# EAGLE schematic Mobo-v07 (EAGLE 5.09)

## Sheet 1 of 5
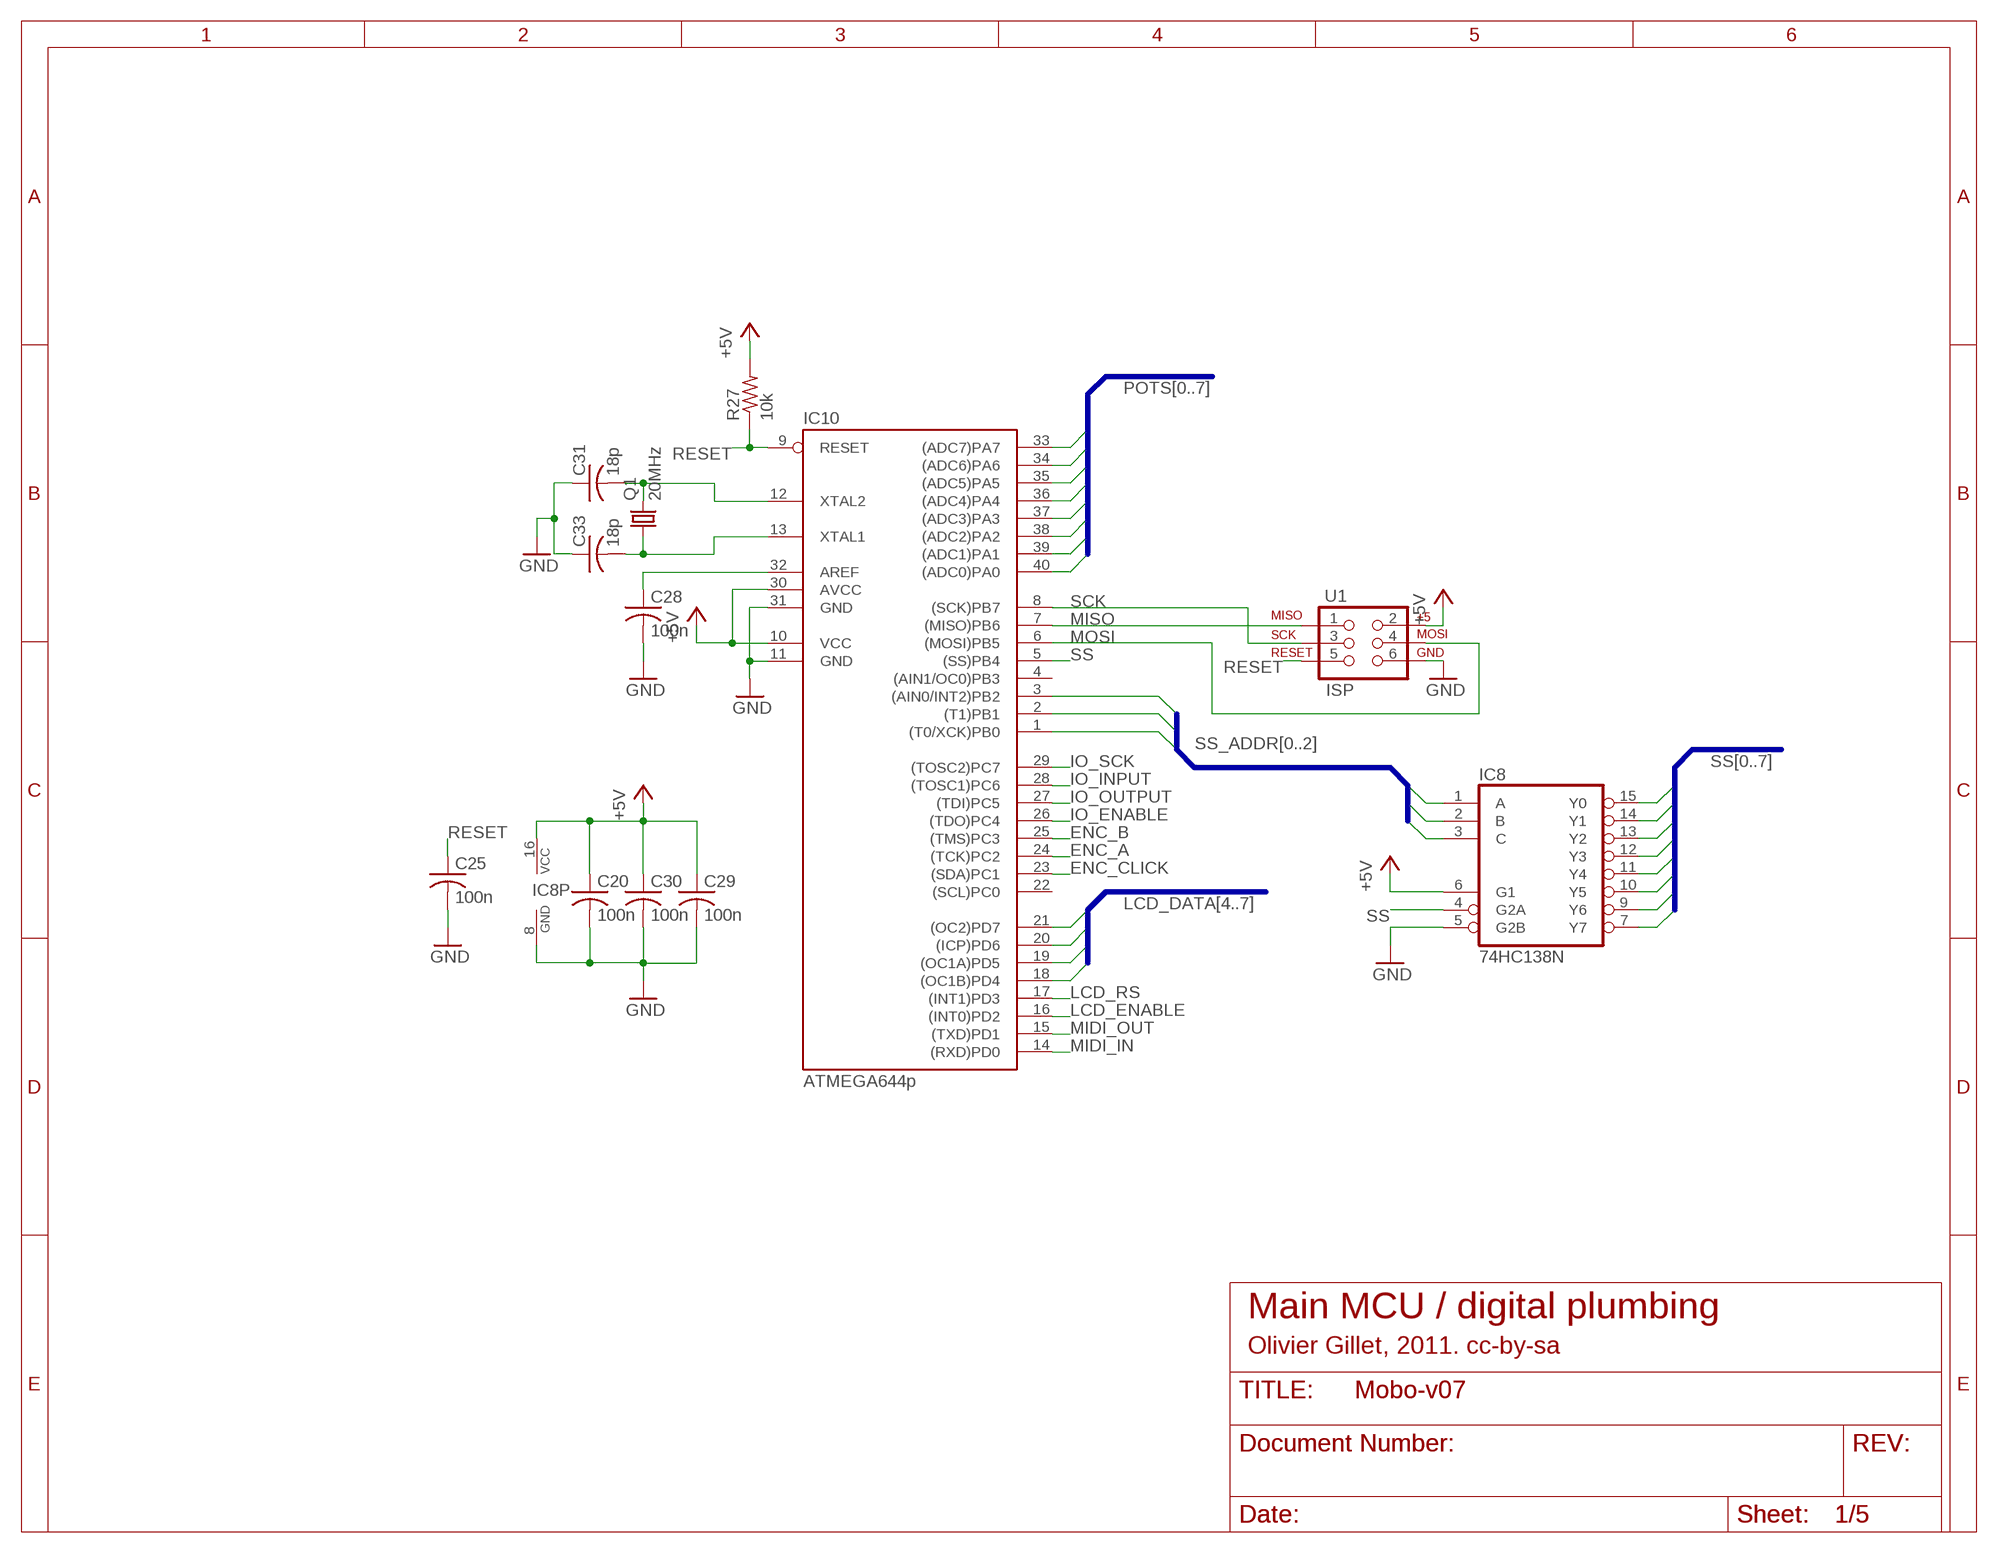
[diagram p0: schematic, sheet 1]

### Parts
C20  100n  C-US025-024X044  [C025-024X044]
C25  100n  C-US025-024X044  [C025-024X044]
C28  100n  C-US025-024X044  [C025-024X044]
C29  100n  C-US025-024X044  [C025-024X044]
C30  100n  C-US025-024X044  [C025-024X044]
C31  18p  C-US025-024X044  [C025-024X044]
C33  18p  C-US025-024X044  [C025-024X044]
IC8  74HC138N  [DIL16]
IC10  ATMEGA644p  MEGA16-P  [DIL40]
Q1  20MHz  CRYSTALHC49U-V  [HC49U-V]
R27  10k  R-US_0204/7  [0204/7]
U1  ISP  AVR_SPI_PRG_6PTH  [2X3]

### Nets
+5V: C20.1 C29.1 C30.1 IC8.6(G1) IC8.16(VCC) IC10.10(VCC) IC10.30(AVCC) R27.2 U1.2 ; also sheet 2,3,4,5
ENC_A: IC10.24((TCK)PC2) ; also sheet 2
ENC_B: IC10.25((TMS)PC3) ; also sheet 2
ENC_CLICK: IC10.23((SDA)PC1) ; also sheet 2
GND: C20.2 C25.2 C28.2 C29.2 C30.2 C31.1 C33.1 IC8.5(G2B) IC8.8(GND) IC10.11(GND) IC10.31(GND) U1.6 ; also sheet 2,3,4,5
IO_ENABLE: IC10.26((TDO)PC4) ; also sheet 2
IO_INPUT: IC10.28((TOSC1)PC6) ; also sheet 2
IO_OUTPUT: IC10.27((TDI)PC5) ; also sheet 2
IO_SCK: IC10.29((TOSC2)PC7) ; also sheet 2
LCD_DATA4: IC10.18((OC1B)PD4) ; also sheet 2
LCD_DATA5: IC10.19((OC1A)PD5) ; also sheet 2
LCD_DATA6: IC10.20((ICP)PD6) ; also sheet 2
LCD_DATA7: IC10.21((OC2)PD7) ; also sheet 2
LCD_ENABLE: IC10.16((INT0)PD2) ; also sheet 2
LCD_RS: IC10.17((INT1)PD3) ; also sheet 2
MIDI_IN: IC10.14((RXD)PD0) ; also sheet 3
MIDI_OUT: IC10.15((TXD)PD1) ; also sheet 3
MISO: IC10.7((MISO)PB6) U1.1 ; also sheet 3,4
MOSI: IC10.6((MOSI)PB5) U1.4 ; also sheet 3,4
N$7: C28.1 IC10.32(AREF)
N$82: C33.2 IC10.13(XTAL1) Q1.1
N$83: C31.2 IC10.12(XTAL2) Q1.2
POTS0: IC10.40((ADC0)PA0) ; also sheet 2
POTS1: IC10.39((ADC1)PA1) ; also sheet 2
POTS2: IC10.38((ADC2)PA2) ; also sheet 2
POTS3: IC10.37((ADC3)PA3) ; also sheet 2
POTS4: IC10.36((ADC4)PA4) ; also sheet 2
POTS5: IC10.35((ADC5)PA5) ; also sheet 2
POTS6: IC10.34((ADC6)PA6) ; also sheet 2
POTS7: IC10.33((ADC7)PA7) ; also sheet 2
RESET: C25.1 IC10.9(RESET) R27.1 U1.5
SCK: IC10.8((SCK)PB7) U1.3 ; also sheet 3,4
SS: IC8.4(G2A) IC10.5((SS)PB4)
SS0: IC8.15(Y0) ; also sheet 4
SS1: IC8.14(Y1) ; also sheet 4
SS2: IC8.13(Y2) ; also sheet 4
SS3: IC8.12(Y3) ; also sheet 4
SS4: IC8.11(Y4) ; also sheet 4
SS5: IC8.10(Y5) ; also sheet 4
SS6: IC8.9(Y6) ; also sheet 3
SS7: IC8.7(Y7) ; also sheet 3
SS_ADDR0: IC8.1(A) IC10.1((T0/XCK)PB0)
SS_ADDR1: IC8.2(B) IC10.2((T1)PB1)
SS_ADDR2: IC8.3(C) IC10.3((AIN0/INT2)PB2)
Unconnected: IC10.4((AIN1/OC0)PB3) IC10.22((SCL)PC0)

### Buses
POTS[0..7]
LCD_DATA[4..7]
SS_ADDR[0..2]
SS[0..7]

### Notes on the sheet
- Main MCU / digital plumbing
- Olivier Gillet, 2011. cc-by-sa

## Sheet 2 of 5
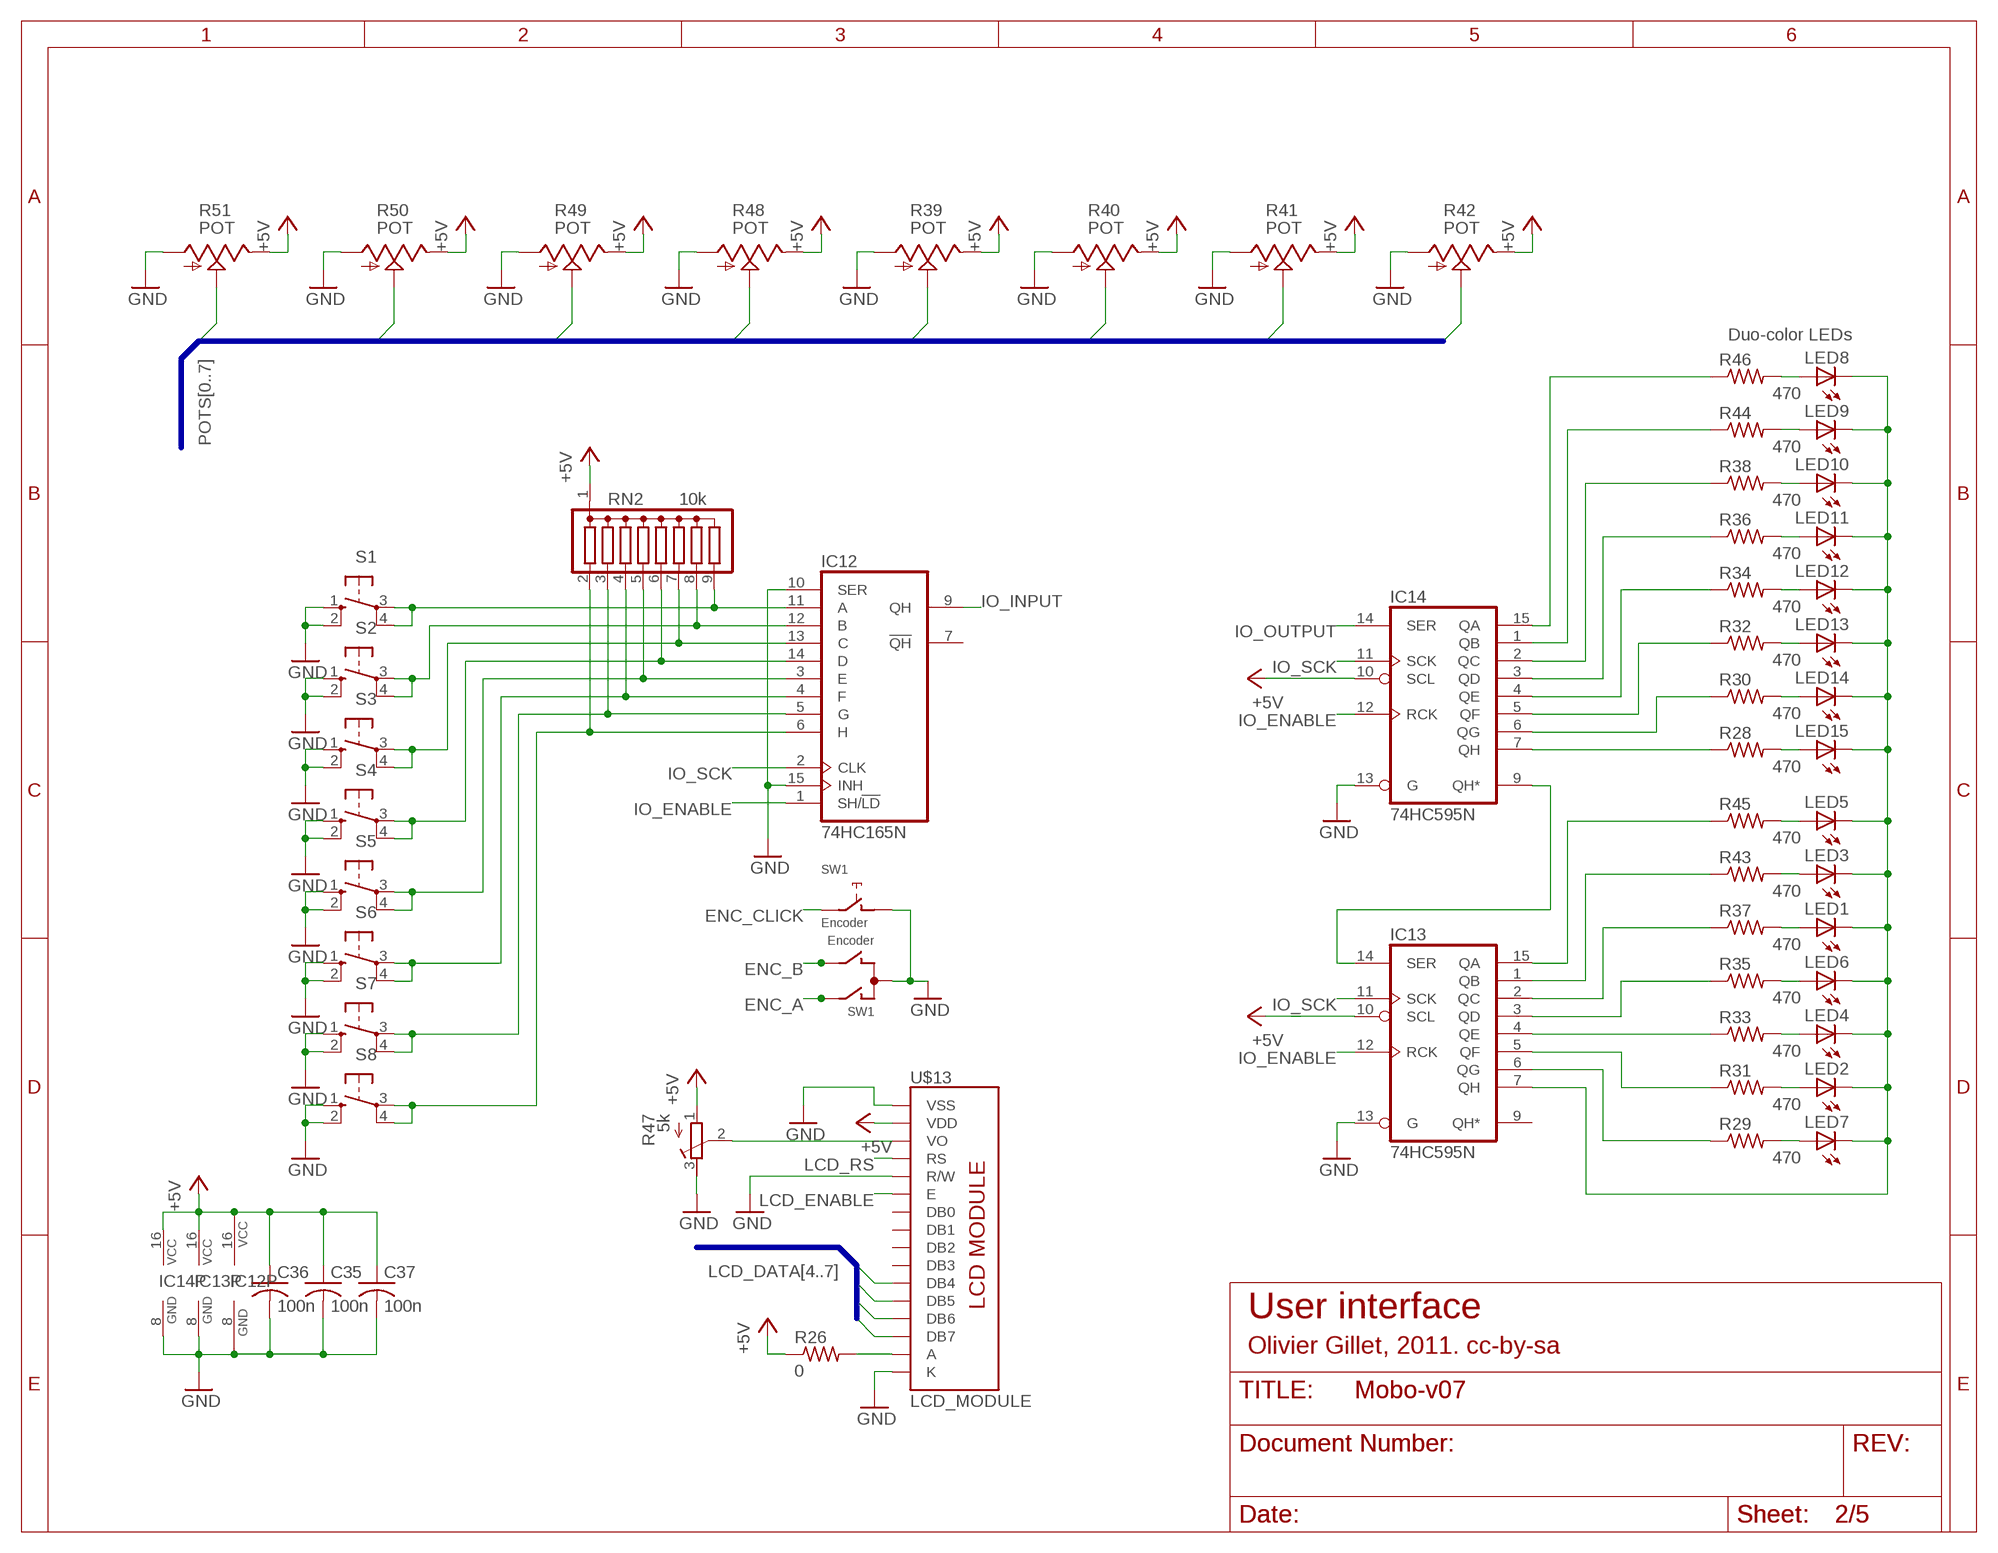
[diagram p1: schematic, sheet 2]

### Parts
C35  100n  C-US025-024X044  [C025-024X044]
C36  100n  C-US025-024X044  [C025-024X044]
C37  100n  C-US025-024X044  [C025-024X044]
IC12  74HC165N  74LS165N  [DIL16]
IC13  74HC595N  [DIL16]
IC14  74HC595N  [DIL16]
LED1  LED3MM  [LED3MM]
LED2  LED3MM  [LED3MM]
LED3  LED3MM  [LED3MM]
LED4  LED3MM  [LED3MM]
LED5  LED3MM  [LED3MM]
LED6  LED3MM  [LED3MM]
LED7  LED3MM  [LED3MM]
LED8  LED3MM  [LED3MM]
LED9  LED3MM  [LED3MM]
LED10  LED3MM  [LED3MM]
LED11  LED3MM  [LED3MM]
LED12  LED3MM  [LED3MM]
LED13  LED3MM  [LED3MM]
LED14  LED3MM  [LED3MM]
LED15  LED3MM  [LED3MM]
R26  0  R-US_0204/7  [0204/7]
R28  470  R-US_0204/7  [0204/7]
R29  470  R-US_0204/7  [0204/7]
R30  470  R-US_0204/7  [0204/7]
R31  470  R-US_0204/7  [0204/7]
R32  470  R-US_0204/7  [0204/7]
R33  470  R-US_0204/7  [0204/7]
R34  470  R-US_0204/7  [0204/7]
R35  470  R-US_0204/7  [0204/7]
R36  470  R-US_0204/7  [0204/7]
R37  470  R-US_0204/7  [0204/7]
R38  470  R-US_0204/7  [0204/7]
R39  POT  POT_USVERTICAL  [ALPS_POT_VERTICAL]
R40  POT  POT_USVERTICAL  [ALPS_POT_VERTICAL]
R41  POT  POT_USVERTICAL  [ALPS_POT_VERTICAL]
R42  POT  POT_USVERTICAL  [ALPS_POT_VERTICAL]
R43  470  R-US_0204/7  [0204/7]
R44  470  R-US_0204/7  [0204/7]
R45  470  R-US_0204/7  [0204/7]
R46  470  R-US_0204/7  [0204/7]
R47  5k  R-TRIMM3339P  [RTRIM3339P]
R48  POT  POT_USVERTICAL  [ALPS_POT_VERTICAL]
R49  POT  POT_USVERTICAL  [ALPS_POT_VERTICAL]
R50  POT  POT_USVERTICAL  [ALPS_POT_VERTICAL]
R51  POT  POT_USVERTICAL  [ALPS_POT_VERTICAL]
RN2  10k  G08R  [SIL9]
S1  40-XX  [B3F-40XX]
S2  40-XX  [B3F-40XX]
S3  40-XX  [B3F-40XX]
S4  40-XX  [B3F-40XX]
S5  40-XX  [B3F-40XX]
S6  40-XX  [B3F-40XX]
S7  40-XX  [B3F-40XX]
S8  40-XX  [B3F-40XX]
SW1  Encoder  EC12E_SW  [ALPS_EC12E_SW]
U$13  LCD_MODULE  [LCD_MODULE_2X40]

### Nets
+5V: C35.1 C36.1 C37.1 IC12.16(VCC) IC13.10(SCL) IC13.16(VCC) IC14.10(SCL) IC14.16(VCC) R26.1 R39.P$1(E) R40.P$1(E) R41.P$1(E) R42.P$1(E) R47.1(E) R48.P$1(E) R49.P$1(E) R50.P$1(E) R51.P$1(E) RN2.1 U$13.2(VDD) ; also sheet 1,3,4,5
ENC_A: SW1.A ; also sheet 1
ENC_B: SW1.B ; also sheet 1
ENC_CLICK: SW1.E ; also sheet 1
GND: C35.2 C36.2 C37.2 IC12.8(GND) IC12.10(SER) IC12.15(INH) IC13.8(GND) IC13.13(G) IC14.8(GND) IC14.13(G) R39.P$3(A) R40.P$3(A) R41.P$3(A) R42.P$3(A) R47.3(A) R48.P$3(A) R49.P$3(A) R50.P$3(A) R51.P$3(A) S1.1(S) S1.2(S1) S2.1(S) S2.2(S1) S3.1(S) S3.2(S1) S4.1(S) S4.2(S1) S5.1(S) S5.2(S1) S6.1(S) S6.2(S1) S7.1(S) S7.2(S1) S8.1(S) S8.2(S1) SW1.C SW1.D U$13.1(VSS) U$13.5(R/W) U$13.16(K) ; also sheet 1,3,4,5
IO_ENABLE: IC12.1(SH/!LD) IC13.12(RCK) IC14.12(RCK) ; also sheet 1
IO_INPUT: IC12.9(QH) ; also sheet 1
IO_OUTPUT: IC14.14(SER) ; also sheet 1
IO_SCK: IC12.2(CLK) IC13.11(SCK) IC14.11(SCK) ; also sheet 1
LCD_DATA4: U$13.11(DB4) ; also sheet 1
LCD_DATA5: U$13.12(DB5) ; also sheet 1
LCD_DATA6: U$13.13(DB6) ; also sheet 1
LCD_DATA7: U$13.14(DB7) ; also sheet 1
LCD_ENABLE: U$13.6(E) ; also sheet 1
LCD_RS: U$13.4(RS) ; also sheet 1
N$1: IC14.2(QC) R38.1
N$2: IC12.3(E) RN2.5 S5.3(P) S5.4(P1)
N$3: IC12.5(G) RN2.3 S7.3(P) S7.4(P1)
N$10: IC12.4(F) RN2.4 S6.3(P) S6.4(P1)
N$12: IC12.14(D) RN2.6 S4.3(P) S4.4(P1)
N$18: R47.2(S) U$13.3(VO)
N$24: IC12.11(A) RN2.9 S1.3(P) S1.4(P1)
N$30: IC14.15(QA) R46.1
N$31: IC14.1(QB) R44.1
N$33: IC14.3(QD) R36.1
N$34: IC14.4(QE) R34.1
N$35: IC14.5(QF) R32.1
N$36: IC14.7(QH) R28.1
N$37: IC14.6(QG) R30.1
N$42: LED8.A R46.2
N$43: LED9.A R44.2
N$44: LED10.A R38.2
N$45: LED11.A R36.2
N$46: LED12.A R34.2
N$47: LED13.A R32.2
N$48: LED14.A R30.2
N$49: LED15.A R28.2
N$51: IC13.7(QH) LED1.K(C) LED2.K(C) LED3.K(C) LED4.K(C) LED5.K(C) LED6.K(C) LED7.K(C) LED8.K(C) LED9.K(C) LED10.K(C) LED11.K(C) LED12.K(C) LED13.K(C) LED14.K(C) LED15.K(C)
N$62: IC13.15(QA) R45.1
N$63: IC13.1(QB) R43.1
N$67: IC13.3(QD) R35.1
N$69: IC13.4(QE) R33.1
N$70: IC13.5(QF) R31.1
N$75: LED5.A R45.2
N$78: LED3.A R43.2
N$79: R26.2 U$13.15(A)
N$80: LED1.A R37.2
N$84: LED6.A R35.2
N$85: LED4.A R33.2
N$86: LED2.A R31.2
N$87: IC13.14(SER) IC14.9(QH*)
N$88: IC12.12(B) RN2.8 S2.3(P) S2.4(P1)
N$89: IC13.2(QC) R37.1
N$90: IC12.13(C) RN2.7 S3.3(P) S3.4(P1)
N$95: IC12.6(H) RN2.2 S8.3(P) S8.4(P1)
N$96: LED7.A R29.2
N$98: IC13.6(QG) R29.1
POTS0: R51.P$2(S) ; also sheet 1
POTS1: R50.P$2(S) ; also sheet 1
POTS2: R49.P$2(S) ; also sheet 1
POTS3: R48.P$2(S) ; also sheet 1
POTS4: R39.P$2(S) ; also sheet 1
POTS5: R40.P$2(S) ; also sheet 1
POTS6: R41.P$2(S) ; also sheet 1
POTS7: R42.P$2(S) ; also sheet 1
Unconnected: IC12.7(!QH) IC13.9(QH*) SW1.GND1(G) SW1.GND2(G) U$13.7(DB0) U$13.8(DB1) U$13.9(DB2) U$13.10(DB3)

### Buses
POTS[0..7]
LCD_DATA[4..7]

### Notes on the sheet
- Duo-color LEDs
- User interface
- Olivier Gillet, 2011. cc-by-sa

## Sheet 3 of 5
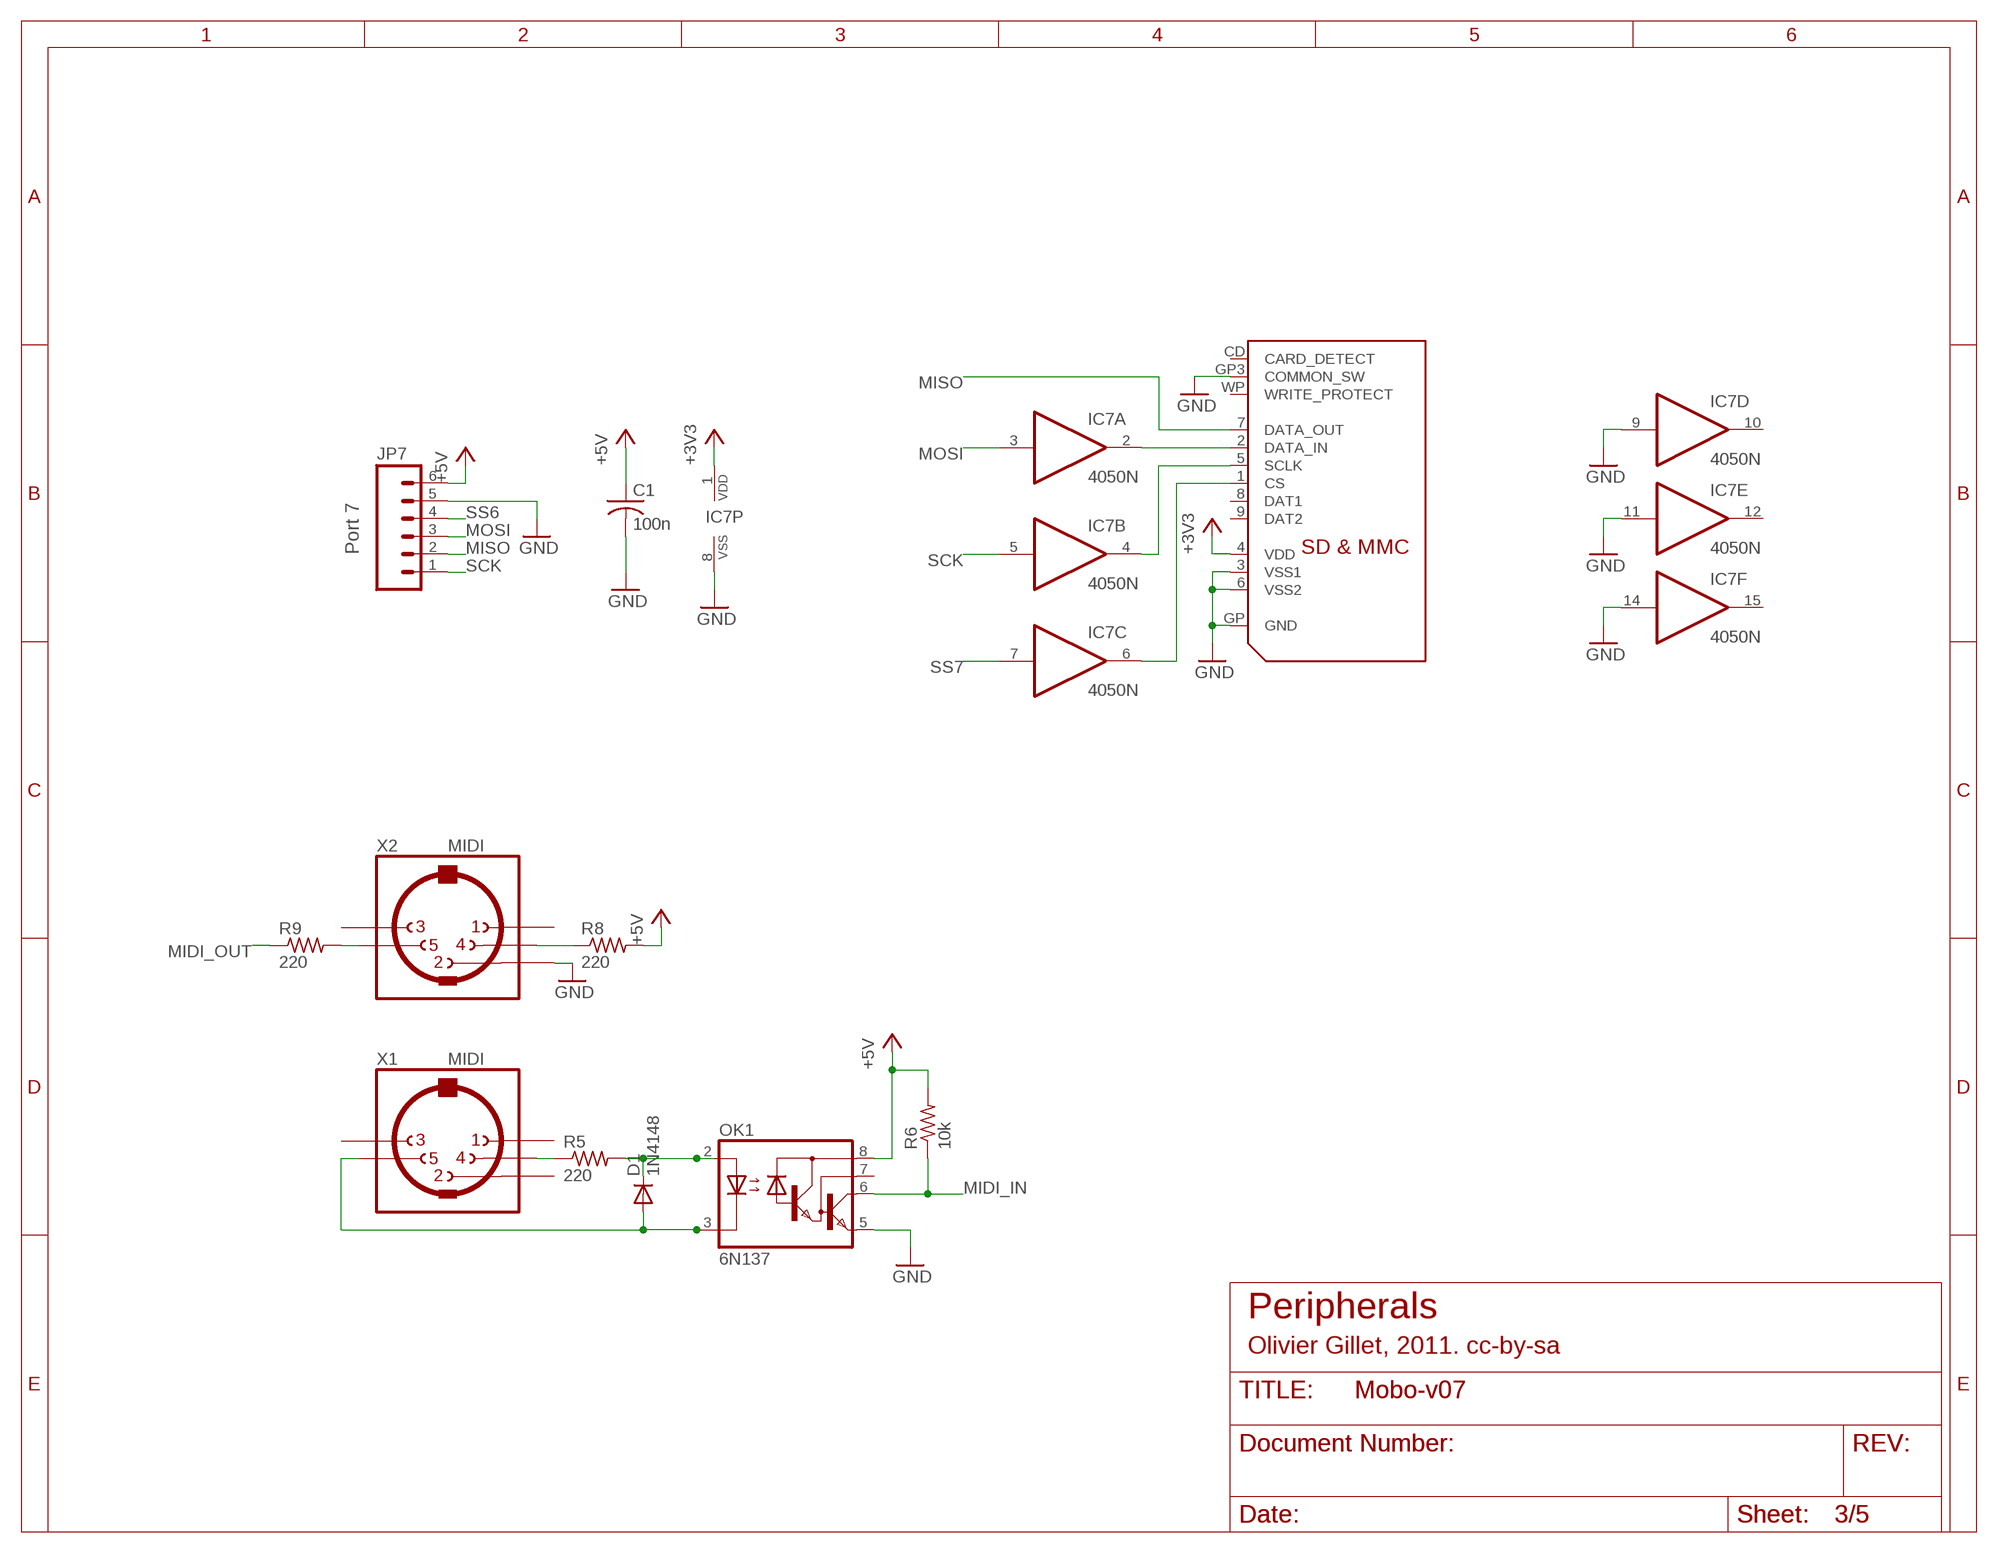
[diagram p2: schematic, sheet 3]

### Parts
C1  100n  C-US025-024X044  [C025-024X044]
D1  1N4148  DIODE-D-5  [D-5]
IC7  4050N  [DIL16]
JP7  M06SIP  [1X06]
OK1  6N137  6N138  [DIL08]
R5  220  R-US_0204/7  [0204/7]
R6  10k  R-US_0204/7  [0204/7]
R8  220  R-US_0204/7  [0204/7]
R9  220  R-US_0204/7  [0204/7]
U$22  SDMMC06132  [06132]
X1  MIDI  MAB5SH  [MAB5SH]
X2  MIDI  MAB5SH  [MAB5SH]

### Nets
+3V3: IC7.1(P:VDD) U$22.4(VDD) ; also sheet 5
+5V: C1.1 JP7.6 OK1.8(VCC) R6.2 R8.2 ; also sheet 1,2,4,5
GND: C1.2 IC7.8(P:VSS) IC7.9(D:I) IC7.11(E:I) IC7.14(F:I) JP7.5 OK1.5(GND) U$22.3(VSS1) U$22.6(VSS2) U$22.GP3(COMMON_SW) U$22.GP(GND) X2.2 ; also sheet 1,2,4,5
MIDI_IN: OK1.6(VO) R6.1 ; also sheet 1
MIDI_OUT: R9.1 ; also sheet 1
MISO: JP7.2 U$22.7(DATA_OUT) ; also sheet 1,4
MOSI: IC7.3(A:I) JP7.3 ; also sheet 1,4
MOSI_3V3: IC7.2(A:O) U$22.2(DATA_IN)
N$5: R9.2 X2.5
N$28: D1.C OK1.2(A) R5.2
N$68: R8.1 X2.4
N$72: R5.1 X1.4
N$73: D1.A OK1.3(C) X1.5
SCK: IC7.5(B:I) JP7.1 ; also sheet 1,4
SCK_3V3: IC7.4(B:O) U$22.5(SCLK)
SS6: JP7.4 ; also sheet 1
SS7: IC7.7(C:I) ; also sheet 1
SS7_3V3: IC7.6(C:O) U$22.1(CS)
Unconnected: IC7.10(D:O) IC7.12(E:O) IC7.15(F:O) OK1.7(VB) U$22.8(DAT1) U$22.9(DAT2) U$22.CD(CARD_DETECT) U$22.WP(WRITE_PROTECT) X1.1 X1.2 X1.3 X2.1 X2.3

### Notes on the sheet
- Port 7
- Peripherals
- Olivier Gillet, 2011. cc-by-sa

## Sheet 4 of 5
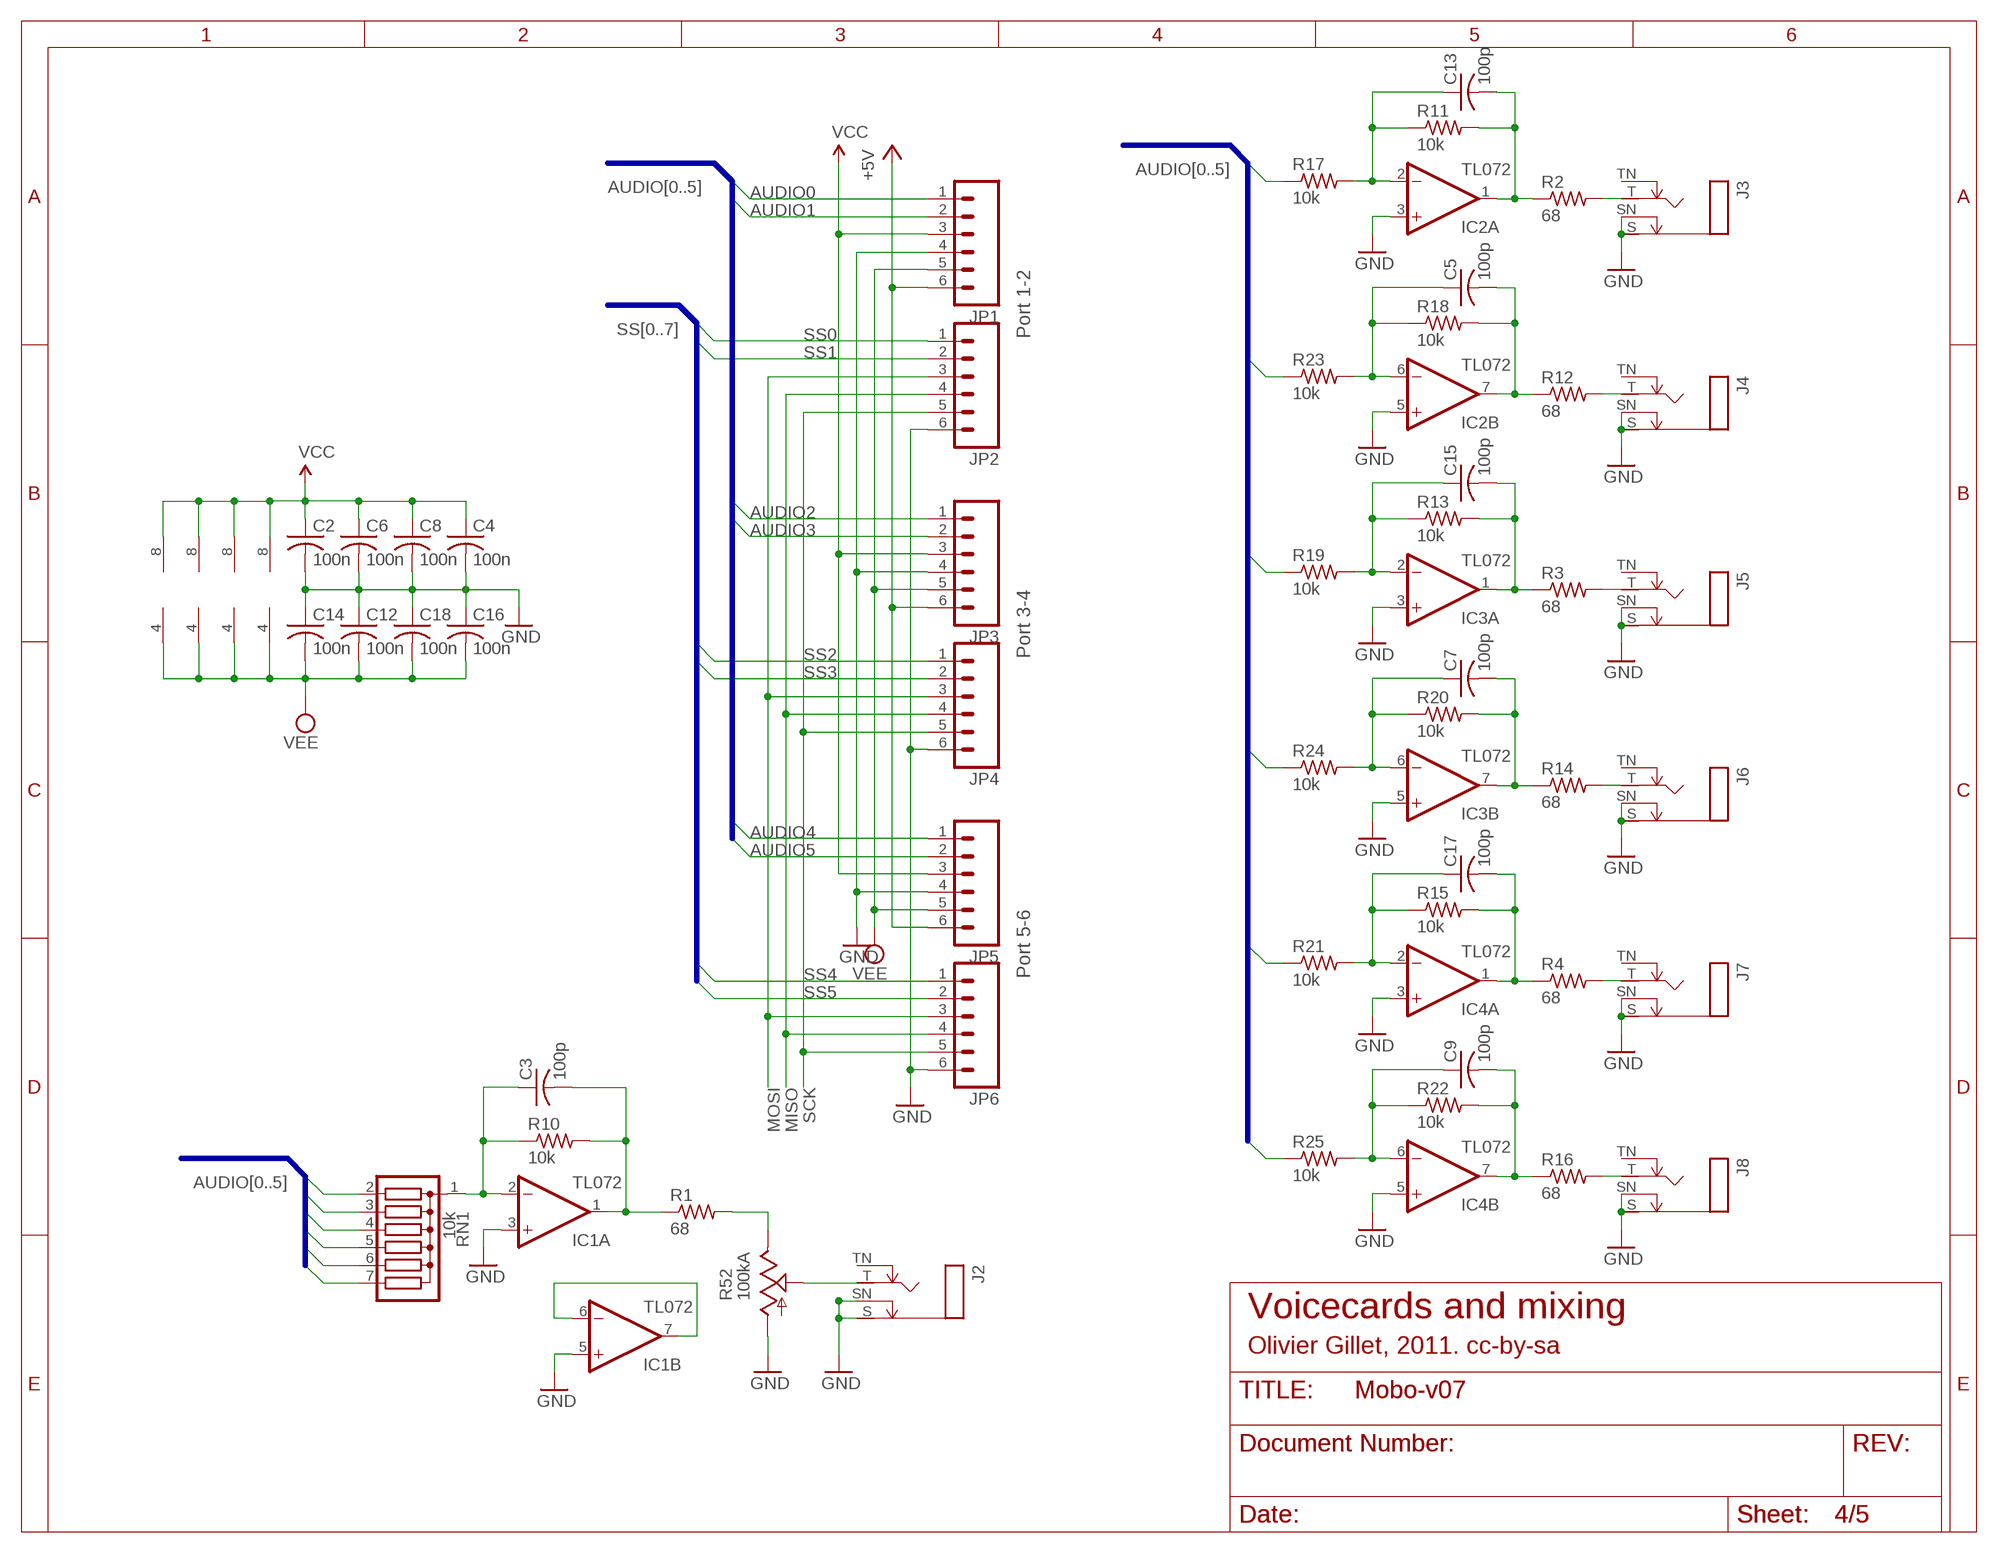
[diagram p3: schematic, sheet 4]

### Parts
C2  100n  C-US025-024X044  [C025-024X044]
C3  100p  C-US025-024X044  [C025-024X044]
C4  100n  C-US025-024X044  [C025-024X044]
C5  100p  C-US025-024X044  [C025-024X044]
C6  100n  C-US025-024X044  [C025-024X044]
C7  100p  C-US025-024X044  [C025-024X044]
C8  100n  C-US025-024X044  [C025-024X044]
C9  100p  C-US025-024X044  [C025-024X044]
C12  100n  C-US025-024X044  [C025-024X044]
C13  100p  C-US025-024X044  [C025-024X044]
C14  100n  C-US025-024X044  [C025-024X044]
C15  100p  C-US025-024X044  [C025-024X044]
C16  100n  C-US025-024X044  [C025-024X044]
C17  100p  C-US025-024X044  [C025-024X044]
C18  100n  C-US025-024X044  [C025-024X044]
IC1  TL072  TL082P  [DIL08]
IC2  TL072  TL082P  [DIL08]
IC3  TL072  TL082P  [DIL08]
IC4  TL072  TL082P  [DIL08]
J2  MONOSWSLIM  [NRJ4HF]
J3  MONOSWSLIM  [NRJ4HF]
J4  MONOSWSLIM  [NRJ4HF]
J5  MONOSWSLIM  [NRJ4HF]
J6  MONOSWSLIM  [NRJ4HF]
J7  MONOSWSLIM  [NRJ4HF]
J8  MONOSWSLIM  [NRJ4HF]
JP1  M06SIP  [1X06]
JP2  M06SIP  [1X06]
JP3  M06SIP  [1X06]
JP4  M06SIP  [1X06]
JP5  M06SIP  [1X06]
JP6  M06SIP  [1X06]
R1  68  R-US_0204/7  [0204/7]
R2  68  R-US_0204/7  [0204/7]
R3  68  R-US_0204/7  [0204/7]
R4  68  R-US_0204/7  [0204/7]
R10  10k  R-US_0204/7  [0204/7]
R11  10k  R-US_0204/7  [0204/7]
R12  68  R-US_0204/7  [0204/7]
R13  10k  R-US_0204/7  [0204/7]
R14  68  R-US_0204/7  [0204/7]
R15  10k  R-US_0204/7  [0204/7]
R16  68  R-US_0204/7  [0204/7]
R17  10k  R-US_0204/7  [0204/7]
R18  10k  R-US_0204/7  [0204/7]
R19  10k  R-US_0204/7  [0204/7]
R20  10k  R-US_0204/7  [0204/7]
R21  10k  R-US_0204/7  [0204/7]
R22  10k  R-US_0204/7  [0204/7]
R23  10k  R-US_0204/7  [0204/7]
R24  10k  R-US_0204/7  [0204/7]
R25  10k  R-US_0204/7  [0204/7]
R52  100kA  POT_USVERTICAL  [ALPS_POT_VERTICAL]
RN1  10k  G06R  [SIL7]

### Nets
+5V: JP1.6 JP3.6 JP5.6 ; also sheet 1,2,3,5
AUDIO0: JP1.1 R17.1 RN1.2
AUDIO1: JP1.2 R23.1 RN1.3
AUDIO2: JP3.1 R19.1 RN1.4
AUDIO3: JP3.2 R24.1 RN1.5
AUDIO4: JP5.1 R21.1 RN1.6
AUDIO5: JP5.2 R25.1 RN1.7
GND: C2.2 C4.2 C6.2 C8.2 C12.1 C14.1 C16.1 C18.1 IC1.3(A:+IN) IC1.5(B:+IN) IC2.3(A:+IN) IC2.5(B:+IN) IC3.3(A:+IN) IC3.5(B:+IN) IC4.3(A:+IN) IC4.5(B:+IN) J2.S J2.SN J3.S J3.SN J4.S J4.SN J5.S J5.SN J6.S J6.SN J7.S J7.SN J8.S J8.SN JP1.4 JP2.6 JP3.4 JP4.6 JP5.4 JP6.6 R52.P$3(A) ; also sheet 1,2,3,5
MISO: JP2.4 JP4.4 JP6.4 ; also sheet 1,3
MOSI: JP2.3 JP4.3 JP6.3 ; also sheet 1,3
N$6: C3.2 IC1.1(A:OUT) R1.1 R10.2
N$9: C3.1 IC1.2(A:-IN) R10.1 RN1.1
N$11: R1.2 R52.P$1(E)
N$14: C17.2 IC4.1(A:OUT) R4.1 R15.2
N$16: C13.1 IC2.2(A:-IN) R11.1 R17.2
N$17: C13.2 IC2.1(A:OUT) R2.1 R11.2
N$19: J3.T R2.2
N$23: C15.1 IC3.2(A:-IN) R13.1 R19.2
N$26: C5.1 IC2.6(B:-IN) R18.1 R23.2
N$27: C5.2 IC2.7(B:OUT) R12.1 R18.2
N$32: J4.T R12.2
N$38: C15.2 IC3.1(A:OUT) R3.1 R13.2
N$40: J5.T R3.2
N$41: J2.T R52.P$2(S)
N$54: C7.1 IC3.6(B:-IN) R20.1 R24.2
N$55: C7.2 IC3.7(B:OUT) R14.1 R20.2
N$57: J6.T R14.2
N$60: C17.1 IC4.2(A:-IN) R15.1 R21.2
N$64: J7.T R4.2
N$71: C9.1 IC4.6(B:-IN) R22.1 R25.2
N$74: C9.2 IC4.7(B:OUT) R16.1 R22.2
N$76: J8.T R16.2
N$81: IC1.6(B:-IN) IC1.7(B:OUT)
SCK: JP2.5 JP4.5 JP6.5 ; also sheet 1,3
SS0: JP2.1 ; also sheet 1
SS1: JP2.2 ; also sheet 1
SS2: JP4.1 ; also sheet 1
SS3: JP4.2 ; also sheet 1
SS4: JP6.1 ; also sheet 1
SS5: JP6.2 ; also sheet 1
VCC: C2.1 C4.1 C6.1 C8.1 IC1.8(P:V+) IC2.8(P:V+) IC3.8(P:V+) IC4.8(P:V+) JP1.3 JP3.3 JP5.3 ; also sheet 5
VEE: C12.2 C14.2 C16.2 C18.2 IC1.4(P:V-) IC2.4(P:V-) IC3.4(P:V-) IC4.4(P:V-) JP1.5 JP3.5 JP5.5 ; also sheet 5
Unconnected: J2.TN J3.TN J4.TN J5.TN J6.TN J7.TN J8.TN

### Buses
SS[0..7]
AUDIO[0..5]

### Notes on the sheet
- Port 1-2
- Port 3-4
- Port 5-6
- Voicecards and mixing
- Olivier Gillet, 2011. cc-by-sa

## Sheet 5 of 5
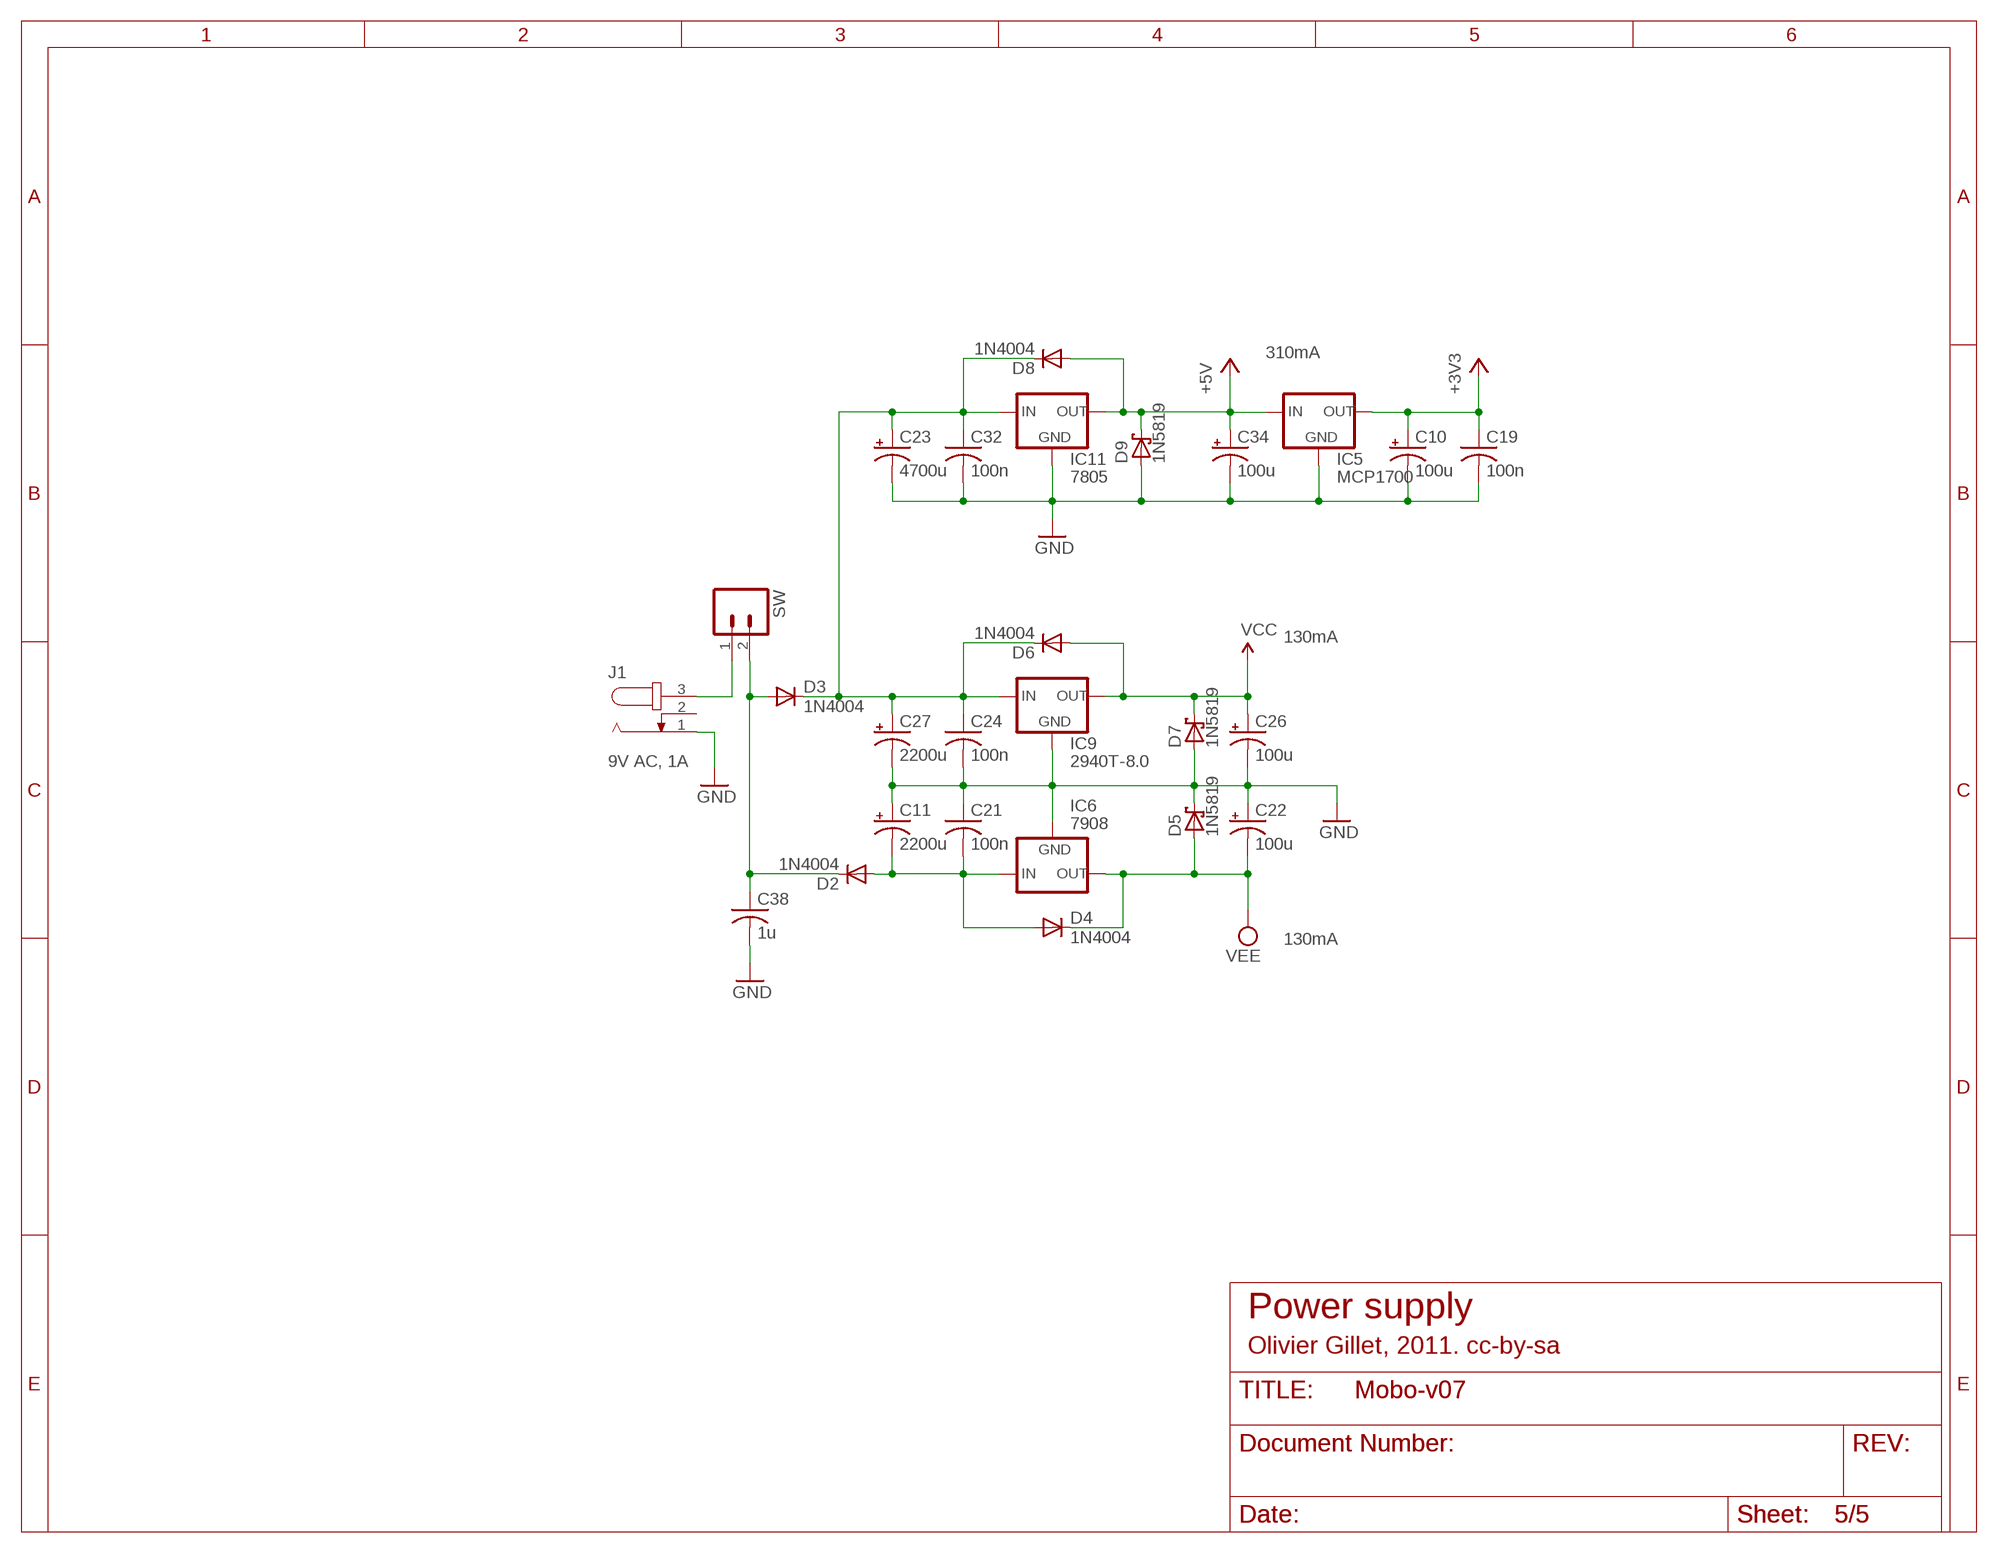
[diagram p4: schematic, sheet 5]

### Parts
C10  100u  CPOL-USE2.5-7  [E2,5-7]
C11  2200u  CPOL-USE5-13  [E5-13]
C19  100n  C-US025-024X044  [C025-024X044]
C21  100n  C-US025-025X050  [C025-025X050]
C22  100u  CPOL-USE2.5-7  [E2,5-7]
C23  4700u  CPOL-USE7.5-16  [E7,5-16]
C24  100n  C-US025-025X050  [C025-025X050]
C26  100u  CPOL-USE2.5-7  [E2,5-7]
C27  2200u  CPOL-USE5-13  [E5-13]
C32  100n  C-US025-025X050  [C025-025X050]
C34  100u  CPOL-USE2.5-7  [E2,5-7]
C38  1u  C-US075-052X106  [C075-052X106]
D2  1N4004  [DO41-10]
D3  1N4004  [DO41-10]
D4  1N4004  [DO41-10]
D5  1N5819  1N5819-T  [DO41-7.6]
D6  1N4004  [DO41-10]
D7  1N5819  1N5819-T  [DO41-7.6]
D8  1N4004  [DO41-10]
D9  1N5819  1N5819-T  [DO41-7.6]
IC5  MCP1700  MCP1700INLINE  [TO92-INLINE]
IC6  7908  79XXS  [79XXS]
IC9  2940T-8.0  78XXL  [78XXL]
IC11  7805  78XXS  [78XXS]
J1  JACK-PLUG2  [SPC4078_BIG_HOLES]
SW  M02PTH  [1X02]

### Nets
+3V3: C10.+ C19.1 IC5.3(OUT) ; also sheet 3
+5V: C34.+ D8.A D9.C IC5.2(IN) IC11.OUT ; also sheet 1,2,3,4
GND: C10.- C11.+ C19.2 C21.1 C22.+ C23.- C24.2 C26.- C27.- C32.2 C34.- C38.2 D5.C D7.A D9.A IC5.1(GND) IC6.GND IC9.GND IC11.GND J1.1 ; also sheet 1,2,3,4
N$4: J1.3 SW.1
N$20: C11.- C21.2 D2.A D4.A IC6.IN
N$25: C23.+ C24.1 C27.+ C32.1 D3.C D6.C D8.C IC9.IN IC11.IN
N$29: C38.1 D2.C D3.A SW.2
VCC: C26.+ D6.A D7.C IC9.OUT ; also sheet 4
VEE: C22.- D4.C D5.A IC6.OUT ; also sheet 4
Unconnected: J1.2

### Notes on the sheet
- 310mA
- 130mA
- 9V AC, 1A
- 130mA
- Power supply
- Olivier Gillet, 2011. cc-by-sa

## Library data of the parts
C1-C9 C12-C21 C24 C25 C28-C33 C35-C38 = rcl:C-US: CAPACITOR, American symbol
C10 C11 C22 C23 C26 C27 C34 = rcl:CPOL-US: POLARIZED CAPACITOR, American symbol
D1 = diode:DIODE-: DIODE
D2-D4 D6 D8 = diode:1N4004: DIODE general purpose rectifier, 1 A
D5 D7 D9 = diode:1N581*: 1.0A SCHOTTKY BARRIER RECTIFIER Source: http://www.diodes.com/datasheets/ds23001.pdf
IC1-IC4 = linear:TL082: OP AMP
IC5 = adafruit:MCP1700: VOLTAGE REGULATOR
IC6 = v-reg:79XXS: VOLTAGE REGULATOR
IC7 = 40xx:4050: Hex non-inverting BUFFER
IC8 = 74xx-eu:74*138: 3-line to 8-line DECODER/DEMULTIPLEXER
IC9 = v-reg:78XXL: VOLTAGE REGULATOR
IC10 = atmel:MEGA16-P: MICROCONTROLLER 16 Kbytes FLASH 1 kbytes SRAM 512 bytes EEPROM USART 8-channel 10 bit ADC Source: avr.lbr
IC11 = v-reg:78XXS: VOLTAGE REGULATOR
IC12 = 74xx-us:74*165: 8-bit parallel load SHIFT REGISTER
IC13 IC14 = 74xx-eu:74*595: 8-bit SHIFT REGISTER, output latch
J1 = con-jack2:JACK-PLUG: DC POWER JACK Power Jack, DC, Right Angle, Through Hole, Rated 5A at 16VDC, PC Terminals Distributor: Farnell (www.Farnell.de) Drawing: 84N1161.pdf / 84N1162.pdf Manufacturer: SPC Technology (www.spctechnology.com) Type: SPC4077 / SPC 4078
J2-J8 = og-neutrik:MONOSW
JP1-JP7 = SparkFun:M06: Header 6 Standard 6-pin 0.1" header. Use with straight break away headers (SKU : PRT-00116), right angle break away headers (PRT-00553), swiss pins (PRT-00743), machine pins (PRT-00117), and female headers (PRT-00115). Molex polarized connector foot print use with SKU : PRT-08094 with associated crimp pins and housings. NOTES ON THE VARIANTS LOCK and LOCK_LONGPADS... This footprint was designed to help hold the alignment of a through-hole component (i.e. 6-pin header) while soldering it into place. You may notice that each hole has been shifted either up or down by 0.005 of an inch from it's more standard position (which is a perfectly straight line). This slight alteration caused the pins (the squares in the middle) to touch the edges of the holes. Because they are alternating, it causes a "brace" to hold the component in place. 0.005 has proven to be the perfect amount of "off-center" position when using our standard breakaway headers. Although looks a little odd when you look at the bare footprint, once you have a header in there, the alteration is very hard to notice. Also, if you push a header all the way into place, it is covered up entirely on the bottom side. This idea of altering the position of holes to aid alignment will be further integrated into the Sparkfun Library for other footprints. It can help hold any component with 3 or more connection pins.
LED1-LED15 = led:LED: LED OSRAM: - CHIPLED LG R971, LG N971, LY N971, LG Q971, LY Q971, LO R971, LY R971 LH N974, LH R974 LS Q976, LO Q976, LY Q976 LO Q996 - Hyper CHIPLED LW Q18S LB Q993, LB Q99A, LB R99A - SideLED LS A670, LO A670, LY A670, LG A670, LP A670 LB A673, LV A673, LT A673, LW A673 LH A674 LY A675 LS A676, LA A676, LO A676, LY A676, LW A676 LS A679, LY A679, LG A679 - Hyper Micro SIDELED® LS Y876, LA Y876, LO Y876, LY Y876 LT Y87S - SmartLED LW L88C, LW L88S LB L89C, LB L89S, LG L890 LS L89K, LO L89K, LY L89K LS L896, LA L896, LO L896, LY L896 - TOPLED LS T670, LO T670, LY T670, LG T670, LP T670 LSG T670, LSP T670, LSY T670, LOP T670, LYG T670 LG T671, LOG T671, LSG T671 LB T673, LV T673, LT T673, LW T673 LH T674 LS T676, LA T676, LO T676, LY T676, LB T676, LH T676, LSB T676, LW T676 LB T67C, LV T67C, LT T67C, LS T67K, LO T67K, LY T67K, LW E67C LS E67B, LA E67B, LO E67B, LY E67B, LB E67C, LV E67C, LT E67C LW T67C LS T679, LY T679, LG T679 LS T770, LO T770, LY T770, LG T770, LP T770 LB T773, LV T773, LT T773, LW T773 LH T774 LS E675, LA E675, LY E675, LS T675 LS T776, LA T776, LO T776, LY T776, LB T776 LHGB T686 LT T68C, LB T68C - Hyper Mini TOPLED® LB M676 - Mini TOPLED Santana® LG M470 LS M47K, LO M47K, LY M47K Source: http://www.osram.convergy.de LUXEON: - LUMILED® LXK2-PW12-R00, LXK2-PW12-S00, LXK2-PW14-U00, LXK2-PW14-V00 LXK2-PM12-R00, LXK2-PM12-S00, LXK2-PM14-U00 LXK2-PE12-Q00, LXK2-PE12-R00, LXK2-PE12-S00, LXK2-PE14-T00, LXK2-PE14-U00 LXK2-PB12-K00, LXK2-PB12-L00, LXK2-PB12-M00, LXK2-PB14-N00, LXK2-PB14-P00, LXK2-PB14-Q00 LXK2-PR12-L00, LXK2-PR12-M00, LXK2-PR14-Q00, LXK2-PR14-R00 LXK2-PD12-Q00, LXK2-PD12-R00, LXK2-PD12-S00 LXK2-PH12-R00, LXK2-PH12-S00 LXK2-PL12-P00, LXK2-PL12-Q00, LXK2-PL12-R00 Source: www.luxeon.com KINGBRIGHT: KA-3528ASYC Source: www.kingbright.com
OK1 = optocoupler:6N138: MOTOROLA OPTO COUPLER
Q1 = crystal:CRYSTAL: CRYSTAL
R1-R6 R8-R38 R43-R46 = rcl:R-US_: RESISTOR, American symbol
R39-R42 R48-R52 = pot-alps:POT_US
R47 = rcl:R-TRIMM: Trimm resistor
RN1 = resistor-sil:G06R: SIL RESISTOR
RN2 = resistor-sil:G08R: SIL RESISTOR
S1-S8 = og-switch:40-XX: OMRON SWITCH
SW = SparkFun:M02: Header 2 Standard 2-pin 0.1" header. Use with straight break away headers (SKU : PRT-00116), right angle break away headers (PRT-00553), swiss pins (PRT-00743), machine pins (PRT-00117), and female headers (PRT-00115). Molex polarized connector foot print use with SKU : PRT-08233 with associated crimp pins and housings.
SW1 = switch-alps:EC12E_SW: ALPS rotary Encoder EC12E series with switch
U1 = SparkFun:AVR_SPI_PRG_6: AVR ISP 6 Pin This is the reduced ISP connector for AVR programming. Common on Arduino. This footprint will take up less PCB space and can be used with a 10-pin to 6-pin adapter such as SKU: BOB-08508
U$13 = og-lcd:LCD_MODULE: Character LCD module
U$22 = adafruit:SDMMC: SD MMC Card holder 4UCON part #06132 - easy to solder
X1 X2 = og-midi:MAB5SH: Female CONNECTOR 5 pins 90 deg. with shield, horizontal (DIN 41524)